# EAGLE schematic alarm clock (EAGLE 5.00)
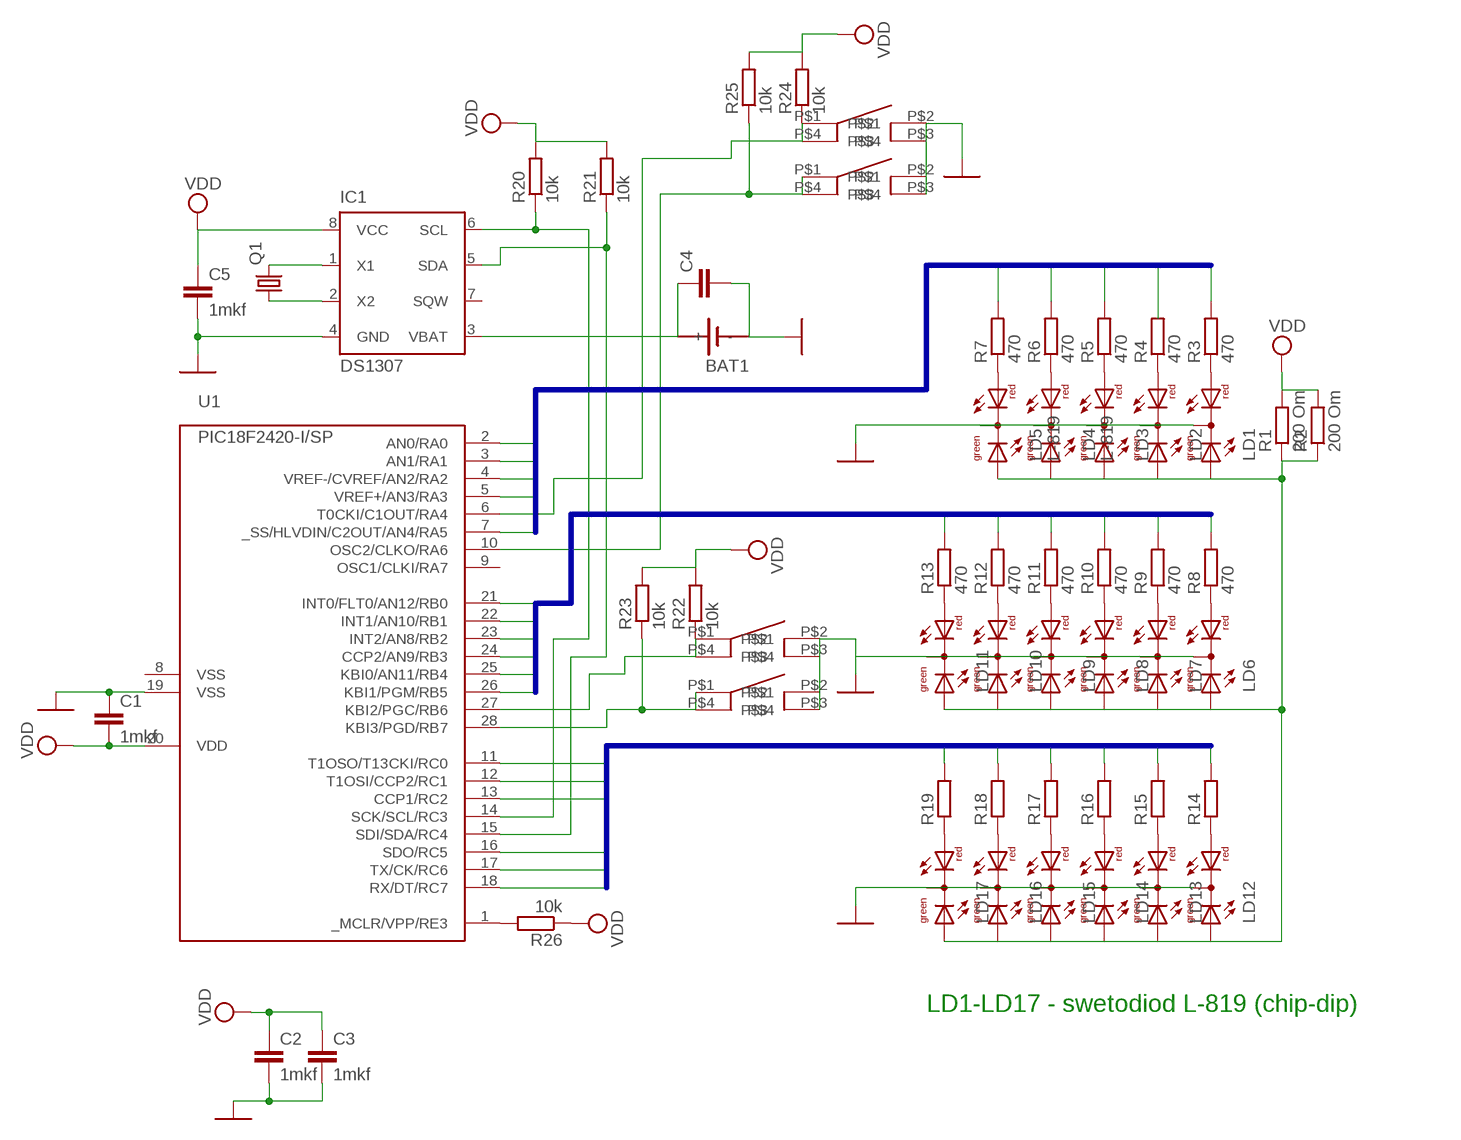
[diagram p0: schematic, sheet 1]

## Parts
BAT1  SN2032  [SN2032]
C1  1mkf  C-1206  [C1206]
C2  1mkf  C-1206  [C1206]
C3  1mkf  C-1206  [C1206]
C4  C-EUC1812  [C1812]
C5  1mkf  C-1206  [C1206]
IC1  DS1307  [DIL08]
LD1  DUOLED-RG-C  [DUOLED-C-5MM]
LD2  DUOLED-RG-C  [DUOLED-C-5MM]
LD3  DUOLED-RG-C  [DUOLED-C-5MM]
LD4  L-819  DUOLED-RG-C  [DUOLED-C-5MM]
LD5  L-819  DUOLED-RG-C  [DUOLED-C-5MM]
LD6  DUOLED-RG-C  [DUOLED-C-5MM]
LD7  DUOLED-RG-C  [DUOLED-C-5MM]
LD8  DUOLED-RG-C  [DUOLED-C-5MM]
LD9  DUOLED-RG-C  [DUOLED-C-5MM]
LD10  DUOLED-RG-C  [DUOLED-C-5MM]
LD11  DUOLED-RG-C  [DUOLED-C-5MM]
LD12  DUOLED-RG-C  [DUOLED-C-5MM]
LD13  DUOLED-RG-C  [DUOLED-C-5MM]
LD14  DUOLED-RG-C  [DUOLED-C-5MM]
LD15  DUOLED-RG-C  [DUOLED-C-5MM]
LD16  DUOLED-RG-C  [DUOLED-C-5MM]
LD17  DUOLED-RG-C  [DUOLED-C-5MM]
Q1  CRYSTALTC38H  [TC38H]
R1  200 Om  R-R1206  [R1206]
R2  200 Om  R-R1206  [R1206]
R3  470  R-R1206  [R1206]
R4  470  R-R1206  [R1206]
R5  470  R-R1206  [R1206]
R6  470  R-R1206  [R1206]
R7  470  R-R1206  [R1206]
R8  470  R-R1206  [R1206]
R9  470  R-R1206  [R1206]
R10  470  R-R1206  [R1206]
R11  470  R-R1206  [R1206]
R12  470  R-R1206  [R1206]
R13  470  R-R1206  [R1206]
R14  R-R1206  [R1206]
R15  R-R1206  [R1206]
R16  R-R1206  [R1206]
R17  R-R1206  [R1206]
R18  R-R1206  [R1206]
R19  R-R1206  [R1206]
R20  10k  R-R1206  [R1206]
R21  10k  R-R1206  [R1206]
R22  10k  R-R1206  [R1206]
R23  10k  R-R1206  [R1206]
R24  10k  R-R1206  [R1206]
R25  10k  R-R1206  [R1206]
R26  10k  R-R1206  [R1206]
U1  PIC18F2420-I/SP  [DIL28-3]
U$1  TIKBUTTON01  [TIKBUTTON01]
U$2  TIKBUTTON01  [TIKBUTTON01]
U$3  TIKBUTTON01  [TIKBUTTON01]
U$4  TIKBUTTON01  [TIKBUTTON01]

## Nets
GND: BAT1.P$2(-) C1.1 C2.2 C3.2 C4.2 C5.2 IC1.4(GND) LD1.C LD2.C LD3.C LD4.C LD5.C LD6.C LD7.C LD8.C LD9.C LD10.C LD11.C LD12.C LD13.C LD14.C LD15.C LD16.C LD17.C U1.19(VSS) U$1.P$2 U$1.P$3 U$2.P$2 U$2.P$3 U$3.P$2 U$3.P$3 U$4.P$2 U$4.P$3
H0: R3.2 U1.2(AN0/RA0)
H1: U1.3(AN1/RA1)
H2: R5.2 U1.4(VREF-/CVREF/AN2/RA2)
H3: R6.2 U1.5(VREF+/AN3/RA3)
H4: R7.2 U1.7(_SS/HLVDIN/C2OUT/AN4/RA5)
M0: R14.2 U1.11(T1OSO/T13CKI/RC0)
M1: R15.2 U1.12(T1OSI/CCP2/RC1)
M2: R16.2 U1.13(CCP1/RC2)
M3: R17.2 U1.16(SDO/RC5)
M4: R18.2 U1.17(TX/CK/RC6)
M5: R19.2 U1.18(RX/DT/RC7)
N$1: LD1.AX(AG) LD2.AX(AG) LD3.AX(AG) LD4.AX(AG) LD5.AX(AG) LD6.AX(AG) LD7.AX(AG) LD8.AX(AG) LD9.AX(AG) LD10.AX(AG) LD11.AX(AG) LD12.AX(AG) LD13.AX(AG) LD14.AX(AG) LD15.AX(AG) LD16.AX(AG) LD17.AX(AG) R1.1 R2.1
N$2: LD1.AR R3.1
N$3: LD2.AR R4.1
N$4: LD3.AR R5.1
N$5: LD4.AR R6.1
N$6: LD5.AR R7.1
N$7: LD6.AR R8.1
N$8: LD7.AR R9.1
N$9: LD8.AR R10.1
N$10: LD9.AR R11.1
N$11: LD10.AR R12.1
N$12: LD11.AR R13.1
N$13: LD12.AR R14.1
N$14: LD13.AR R15.1
N$15: LD14.AR R16.1
N$16: LD15.AR R17.1
N$17: LD16.AR R18.1
N$18: LD17.AR R19.1
N$19: IC1.6(SCL) R20.1 U1.14(SCK/SCL/RC3)
N$20: IC1.5(SDA) R21.1 U1.15(SDI/SDA/RC4)
N$21: IC1.1(X1) Q1.2
N$22: IC1.2(X2) Q1.1
N$23: BAT1.P$1(+) C4.1 IC1.3(VBAT)
N$24: R22.1 U1.27(KBI2/PGC/RB6) U$1.P$1 U$1.P$4
N$25: R23.1 U1.28(KBI3/PGD/RB7) U$2.P$1 U$2.P$4
N$26: R24.1 U1.6(T0CKI/C1OUT/RA4) U$3.P$1 U$3.P$4
N$27: R25.1 U1.10(OSC2/CLKO/RA6) U$4.P$1 U$4.P$4
N$28: R26.2 U1.1(_MCLR/VPP/RE3)
S0: R8.2 U1.21(INT0/FLT0/AN12/RB0)
S1: R9.2 U1.22(INT1/AN10/RB1)
S2: R10.2 U1.23(INT2/AN8/RB2)
S3: R11.2 U1.24(CCP2/AN9/RB3)
S4: R12.2 U1.25(KBI0/AN11/RB4)
S5: R13.2 U1.26(KBI1/PGM/RB5)
VDD: C1.2 C2.1 C3.1 C5.1 IC1.8(VCC) R1.2 R2.2 R20.2 R21.2 R22.2 R23.2 R24.2 R25.2 R26.1 U1.20(VDD)
Unconnected: IC1.7(SQW) R4.2 U1.9(OSC1/CLKI/RA7)

## Buses
S0,S1,S2,S3,S4,S5
H0,H1,H2,H3,H4
M0,M1,M2,M3,M4,M5

## Notes on the sheet
- LD1-LD17 - swetodiod L-819 (chip-dip)

## Power pins joined to a net without a drawn wire
VSS: U1.8(VSS)

## Library data of the parts
BAT1 = sn2032:SN2032: LI BATTERY dip07
C1-C3 C5 = quantum-sensor:C: Capacitor
C4 = rcl:C-EU: CAPACITOR, European symbol
IC1 = ds1307_pcf8583:DS1307: I2C-Bus CLOCK/CALENDAR
LD1-LD17 = led:DUOLED-RG-C: DUO LED 2 colors (red/green), 5 mm, round, common Cathode www.ligitek.com or other producers.
Q1 = crystal:CRYSTAL: CRYSTAL
R1-R26 = quantum-sensor:R: Resistor
U1 = pic18fxx20:PIC18*2420: PIC18*2420 Microchip FLASH Microcontroller with A/D DEVICE FEATURES Feature PIC18*2420 Program Memory (bytes) 16384 Program Memory (instructions) 8192 Interupt Sources 19 I/O Ports Ports A, B, C, (E) Capture/Compare/PWM Modules 2 Enhanced Capture/Compare/PWM Modules 0 Parallel Communications (PSP) No 10-bit Analog-to-Digital Module 10 input Channels Package Types 28-pin PDIP 28-pin SOIC 28-pin QFN NOTES: F only after 18, means standard voltage range from 4.2v to 5.5v LF after 18, means extended voltage range from 2.0v to 5.5v -E before / denotes extended temperature range from -40°C to +120°C -I before / denotes industrial temperature range from -40°C to +85°C /PT suffix denotes TQFP package /SO suffix denotes SOIC package /SP suffix denotes Skinny Plastic DIP package /P suffix denotes Plastic DIP package /ML suffix denotes QFN package T after entire device number, means supplied in tape and reel TQFP packages only
U$1-U$4 = buttons:TIKBUTTON01: button tik